# Altium schematic sheet CLK_16GHz.SchDoc
size A4; SheetNumber: 6; SheetTotal: 15
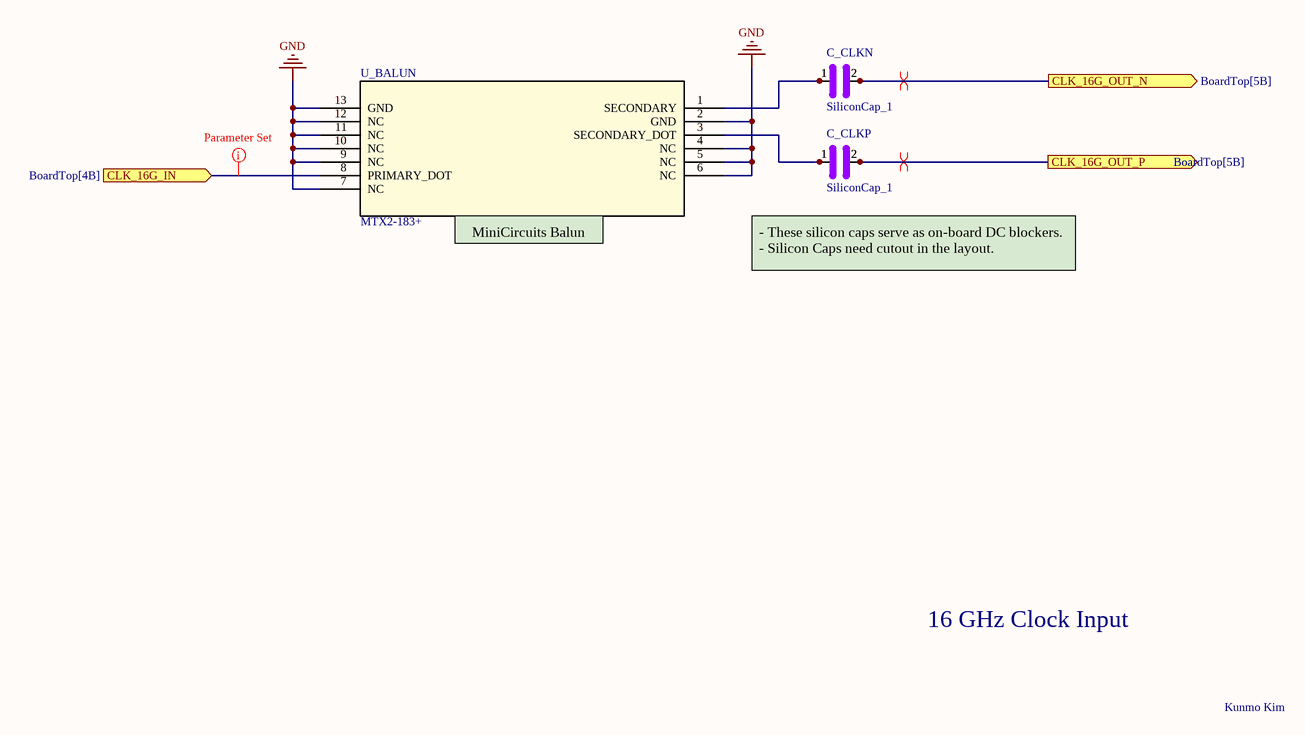
[diagram p0: CLK_16GHz.SchDoc]

## Parts
C_CLKN  SiliconCap_1  [0201-NOSILK]
C_CLKP  SiliconCap_1  [0201-NOSILK]
U_BALUN  MTX2-183+  [DG3006_MNC]

## Ports
CLK_16G_IN (in, see BoardTop[4B]), CLK_16G_OUT_N (out, see BoardTop[5B]), CLK_16G_OUT_P (out, see BoardTop[5B])

## Nets
GND: U_BALUN.2(GND) U_BALUN.4(NC) U_BALUN.5(NC) U_BALUN.6(NC) U_BALUN.7(NC) U_BALUN.9(NC) U_BALUN.10(NC) U_BALUN.11(NC) U_BALUN.12(NC) U_BALUN.13(GND)
CLK_16G_IN: U_BALUN.8(PRIMARY_DOT) ; port CLK_16G_IN
CLK_16G_OUT_N: C_CLKN.2 ; port CLK_16G_OUT_N
CLK_16G_OUT_P: C_CLKP.2 ; port CLK_16G_OUT_P
NetC_CLKN_1: C_CLKN.1 U_BALUN.1(SECONDARY)
NetC_CLKP_1: C_CLKP.1 U_BALUN.3(SECONDARY_DOT)

## Layout directives
differential pair; differential pair class DIFF100; net class DIFF_CLK: CLK_16G_OUT_N, CLK_16G_OUT_P
net class SC50: CLK_16G_IN

## Notes on the sheet
- (near U_BALUN) MiniCircuits Balun
- - These silicon caps serve as on-board DC blockers.
  - Silicon Caps need cutout in the layout.
- 16 GHz Clock Input
- Kunmo Kim

## Library data of the parts
C_CLKN C_CLKP = SiliconCap_1: 939114492510-T3S from Murata; Supplier 1: Digikey; Supplier Part Number 1: 490-939114492510-T3SCT-ND
U_BALUN = MTX2-133+: Mfr_Name: Mini Circuits; RefDes: RefDes; Type: Type; Supplier 1: Mouser; Supplier Part Number 1: 139-MTX2-183+